# EAGLE design SpeechStorageModuleV10 (EAGLE 9.2.2)
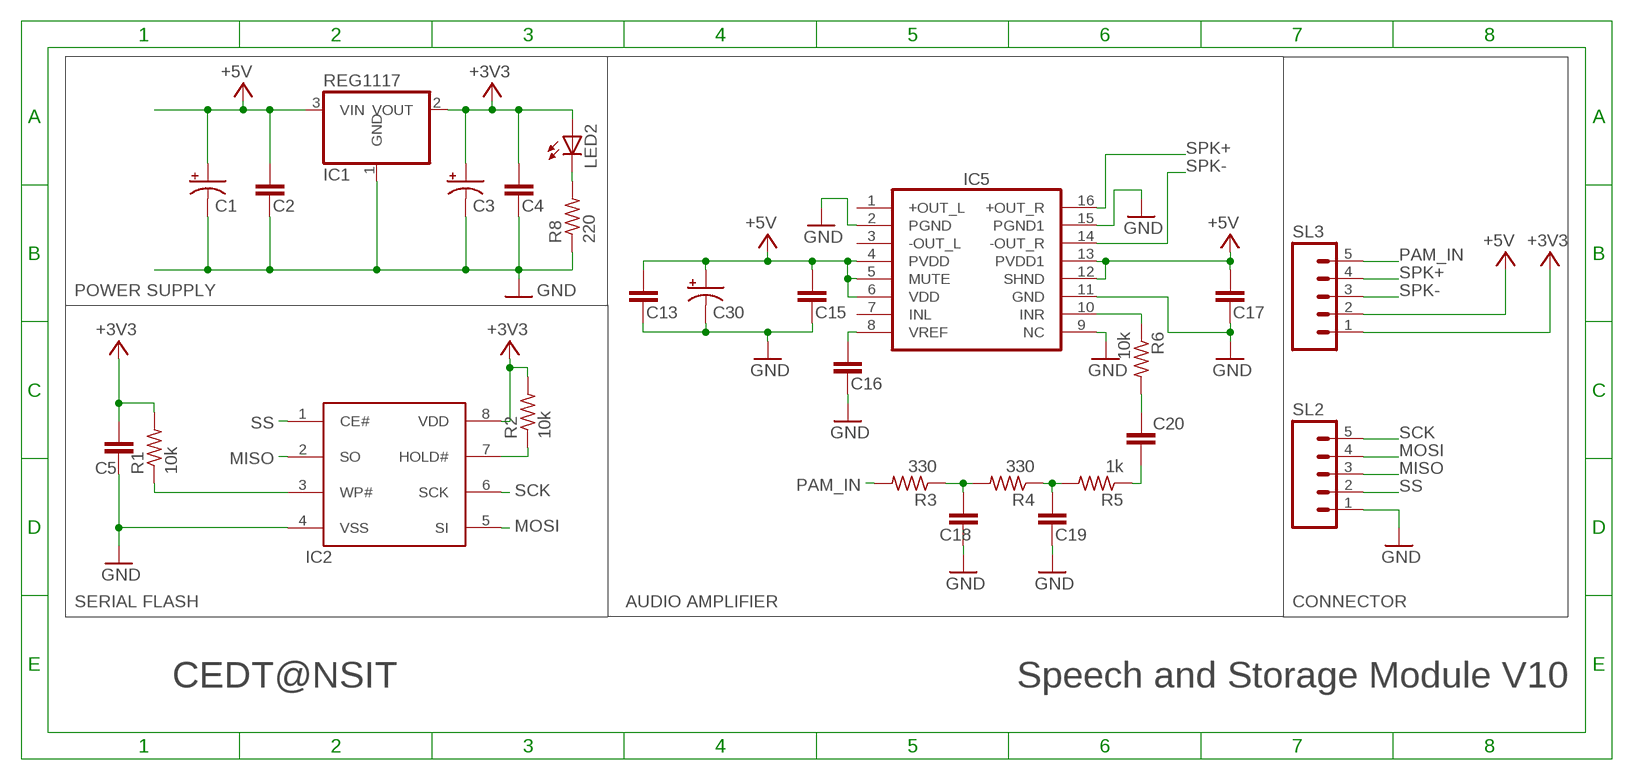
[diagram p0: schematic, sheet 1]

## Parts
C1  10u  CAP_POL_10V  [C/6032-28R]
C2  0.1uF  C-EUC1206  [C1206]
C3  10u  CAP_POL_10V  [C/6032-28R]
C4  0.1uF  C-EUC1206  [C1206]
C5  0.1u  C-EUC0805  [C0805]
C13  1uf  C-EUC1206  [C1206]
C15  1uf  C-EUC1206  [C1206]
C16  0.1uf  C-EUC1206  [C1206]
C17  1uf  C-EUC1206  [C1206]
C18  0.1u  C-EUC0805  [C0805]
C19  0.1uf  C-EUC0805  [C0805]
C20  0.47uF  C-EUC0805  [C0805]
C30  100u  CAP_POL_10V  [C/6032-28R]
IC1  REG1117  [SOT223]
IC2  SST25VF040B_SPI_FLASH  [SOIC08]
IC5  PAM8403  [SOP-16]
LED2  LED0805  [CHIPLED_0805]
R1  10k  RESISTOR0805  [R0805]
R2  10k  RESISTOR0805  [R0805]
R3  330  RESISTOR0805  [R0805]
R4  330  RESISTOR0805  [R0805]
R5  1k  RESISTOR0805  [R0805]
R6  10k  RESISTOR0805  [R0805]
R8  220  RESISTOR0805  [R0805]
SL2  M05  [05P]
SL3  M05  [05P]

## Nets
+3V3: C3.+ C4.2 C5.1 IC1.2(VOUT) IC2.8(VDD) LED2.A R1.2 R2.2 SL3.1
+5V: C1.+ C2.2 C13.1 C15.2 C17.2 C30.+ IC1.3(VIN) IC5.4(PVDD) IC5.5(MUTE) IC5.6(VDD) IC5.12(SHND) IC5.13(PVDD1) SL3.2
GND: C1.- C2.1 C3.- C4.1 C5.2 C13.2 C15.1 C16.2 C17.1 C18.2 C19.2 C30.- IC1.1(GND) IC2.4(VSS) IC5.2(PGND) IC5.9(NC) IC5.11(GND) IC5.15(PGND1) R8.1 SL2.1
MISO: IC2.2(SO) SL2.3
MOSI: IC2.5(SI) SL2.4
N$1: IC2.7(HOLD#) R2.1
N$2: C18.1 R3.1 R4.2
N$3: IC2.3(WP#) R1.1
N$4: C19.1 R4.1 R5.2
N$5: C20.1 R5.1
N$6: C20.2 R6.2
N$11: LED2.C R8.2
N$29: IC5.10(INR) R6.1
N$34: C16.1 IC5.8(VREF)
PAM_IN: R3.2 SL3.5
SCK: IC2.6(SCK) SL2.5
SPK+: IC5.16(+OUT_R) SL3.4
SPK-: IC5.14(-OUT_R) SL3.3
SS: IC2.1(CE#) SL2.2
Unconnected: IC5.1(+OUT_L) IC5.3(-OUT_L) IC5.7(INL)

## Notes on the sheet
- POWER SUPPLY
- SERIAL FLASH | AUDIO AMPLIFIER | CONNECTOR
- CEDT@NSIT | Speech and Storage Module V10

## Library data of the parts
C1 C3 C30 = CEDT_SEPTEMBER_V2:CAP_POL
C2 C4 C5 C13 C15-C17 C20 = rcl:C-EU: CAPACITOR, European symbol
C18 C19 = Arduino_Hackathon_v5:C-EU: CAPACITOR, European symbol
IC1 = CEDT_JANUARY_2015_v5:REG1117: 800mA and 1A Low Dropout (LDO) Positive Regulator 1.8V, 2.5V, 2.85V, 3.3V, 5V, and Adj
IC2 = CEDT_JANUARY_2015_v5:SST25VF040B_SPI_FLASH
IC5 = PAM8403:PAM8403: Dual channel audio amplifier IC - PAM8403
LED2 = CEDT_JANUARY_2015_v5:LED
R1-R6 R8 = CEDT_JANUARY_2015_v5:RESISTOR
SL2 SL3 = con-amp-quick:M05: AMP QUICK CONNECTOR; OC_FARNELL: unknown; OC_NEWARK: unknown

## Net classes
0 default: width 0.406 mm

## Board
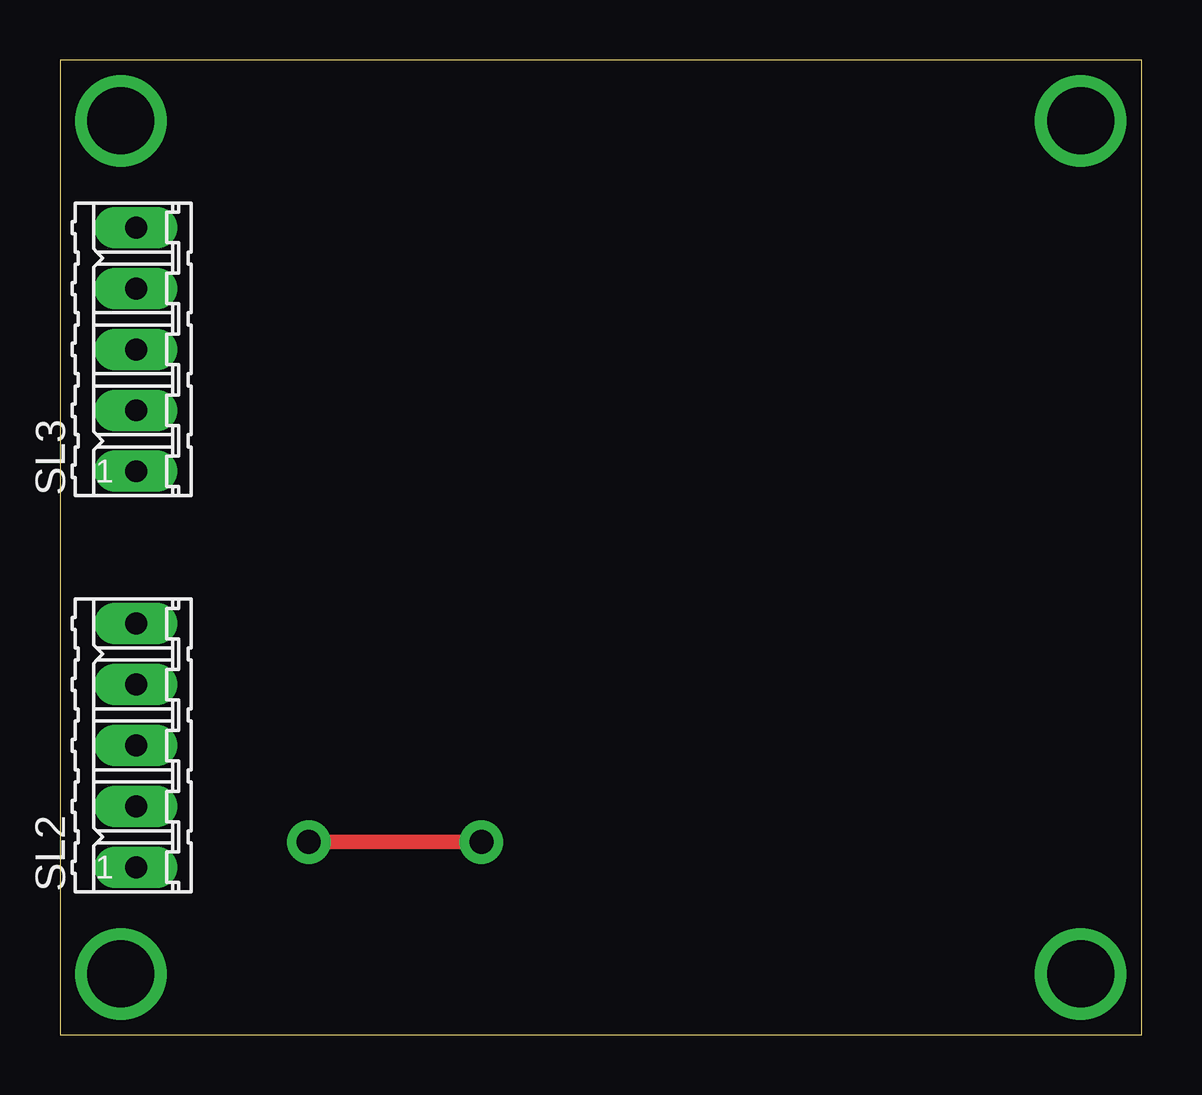
[diagram p1: board, top side]
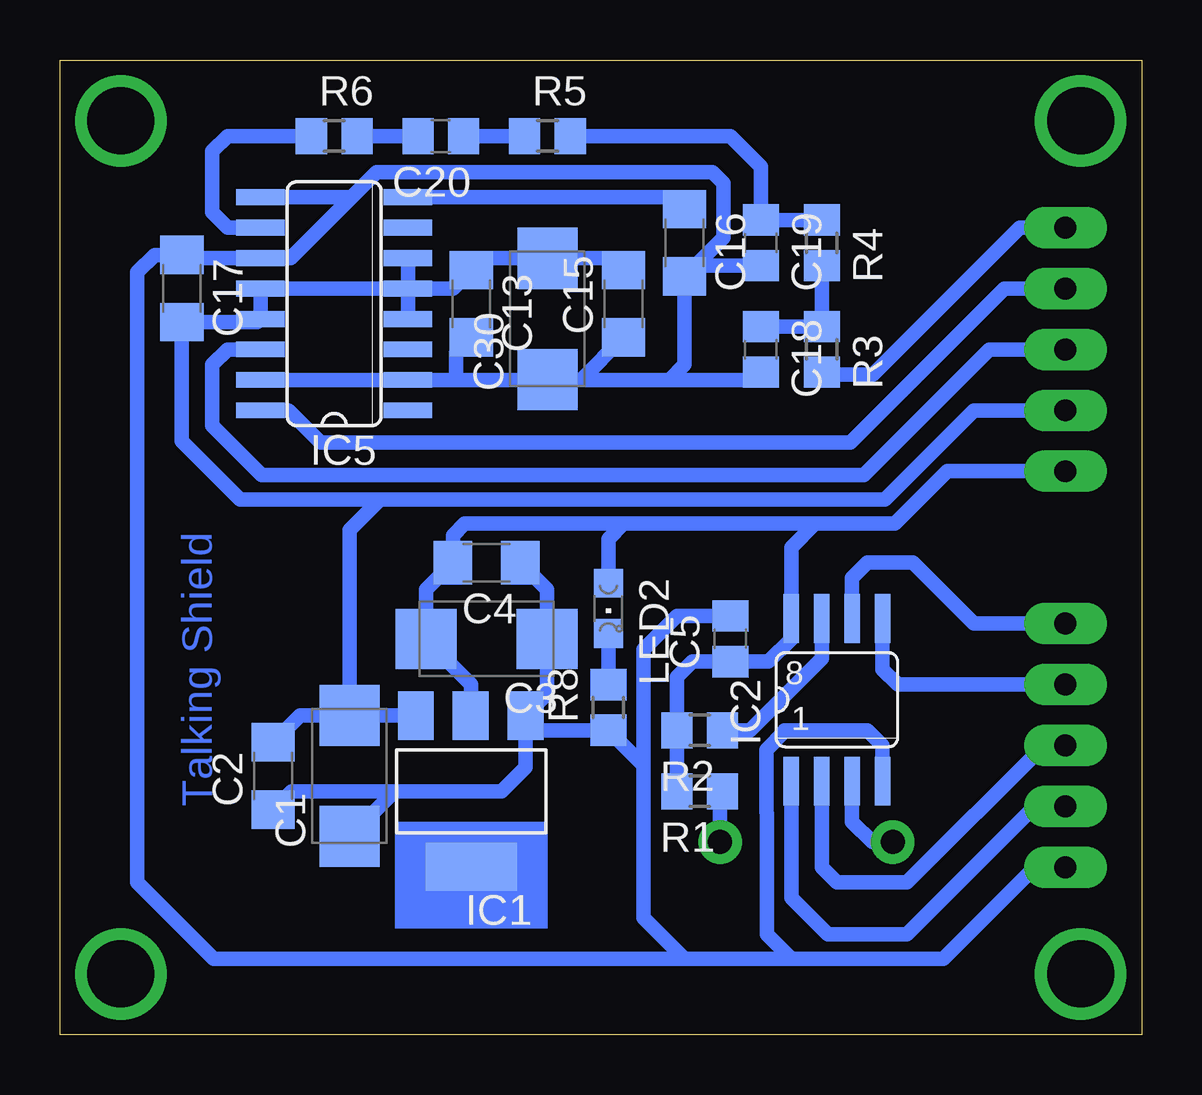
[diagram p2: board, bottom side, seen from below]

Size 45.09 x 40.64 mm. Coordinates in mm from the lower left corner, seen from the top.
Outline: 0,0 45.09,0 45.09,40.64 0,40.63 0,0
Copper layers (1*16): Top 0.035mm / dielectric 1.5mm / Bottom 0.035mm
Design rules "default *": minimum track width 6mil, minimum drill 0.35mm, track to track 16mil, track to pad 16mil, pad to pad 16mil, via to via 16mil, smd to smd 16mil, copper to edge 40mil, drill to drill 6mil, minimum pad ring 16mil, minimum via ring 16mil, stop-mask expansion 4mil, vias tented up to drill 0mil, thermal gap 10mil

### Footprints (pad centres in the part's own frame; a part is rotated, then mirrored left to right if it is on the bottom)
C/6032-28R = smd 2.55 x 2.5: + 2.525,0; - -2.525,0
C1206 = smd 1.6 x 1.8: 1 -1.4,0; 2 1.4,0
C0805 = smd 1.3 x 1.5: 1 -0.95,0; 2 0.95,0
SOT223 = smd 1.499 x 2.007: 1 -2.261,-3.15; 2 0.025,-3.15; 3 2.311,-3.15 | smd 3.81 x 2.007: 4 0,3.15
SOIC08 = smd 0.66 x 2.032: 1 -1.905,-3.391; 2 -0.635,-3.391; 3 0.635,-3.391; 4 1.905,-3.391; 5 1.905,3.391; 6 0.635,3.391; 7 -0.635,3.391; 8 -1.905,3.391
SOP-16 = smd 0.66 x 2.032: 1 -4.445,-3.073; 2 -3.175,-3.073; 3 -1.905,-3.073; 4 -0.635,-3.073; 5 0.635,-3.073; 6 1.905,-3.073; 7 3.175,-3.073; 8 4.445,-3.073; 9 4.445,3.073; 10 3.175,3.073; 11 1.905,3.073; 12 0.635,3.073; 13 -0.635,3.073; 14 -1.905,3.073; 15 -3.175,3.073; 16 -4.445,3.073
CHIPLED_0805 = smd 1.2 x 1.2: A 0,-1.05; C 0,1.05
R0805 = smd 1.3 x 1.5: 1 -0.95,0; 2 0.95,0
05P = drill 0.914 long: 1 -5.08,0; 2 -2.54,0; 3 0,0; 4 2.54,0; 5 5.08,0

### Placement (x,y rotation side)
C1  33.02,10.79 90 bottom
C2  36.2,10.79 90 bottom
C3  27.3,16.51 180 bottom
C4  27.3,19.68 180 bottom
C5  17.14,16.51 90 bottom
C13  27.94,30.48 270 bottom
C15  21.59,30.48 90 bottom
C16  19.05,33.02 270 bottom
C17  40.01,31.11 270 bottom
C18  15.88,28.57 270 bottom
C19  15.88,33.02 270 bottom
C20  29.21,37.47 180 bottom
C30  24.77,29.84 90 bottom
IC1  27.94,10.16 180 bottom
IC2  12.7,13.97 0 bottom
IC5  33.66,30.48 90 bottom
LED2  22.23,17.78 180 bottom
R1  18.41,10.16 180 bottom
R2  18.41,12.7 180 bottom
R3  13.34,28.57 270 bottom
R4  13.34,33.02 270 bottom
R5  24.77,37.47 0 bottom
R6  33.66,37.47 0 bottom
R8  22.23,13.65 90 bottom
SL2  3.17,12.06 90 top
SL3  3.17,28.57 90 top

### Tracks (layer width: path | path; a pad name or v marks a point on that pad's centre or on a via)
+3V3
  Bottom 0.61: R1.2 R2.2 19.36,14.93 18.73,15.56 C5.1 15.55,15.56 14.61,16.51 IC2.8 14.61,20.32 13.61,21.31 | IC1.2 27.94,13.34 27.94,14.61 29.83,16.5 C3.+ 29.83,18.56 C4.2 28.7,20.82 28.22,21.31 21.59,21.31 | LED2.A 22.23,20.68 21.59,21.31 | 21.59,21.31 13.61,21.31 | 13.61,21.31 11.43,21.31 11.21,21.31 10.27,21.31 8.09,23.5 SL3.1
+5V
  Bottom 0.61: IC5.5 IC5.4 | IC5.5 IC5.12 IC5.13 36.86,29.71 C17.2 40.01,24.77 37.57,22.33 31.75,22.33 | IC5.5 IC5.6 | 30.46,13.52 IC1.3 C1.+ | IC5.5 28.7,31.11 C13.1 27.45,32.37 C30.+ 22.08,32.37 C15.2 | 31.75,22.33 33.02,21.06 C1.+ | C1.+ 35.07,13.32 C2.2 | SL3.2 6.99,26.04 10.69,22.33 31.75,22.33
GND
  Bottom 0.61: C19.2 18.6,32.07 | 18.6,32.07 C16.2 19.05,27.94 19.68,27.3 | IC5.9 32.93,34.92 | 32.93,34.92 31.89,35.97 17.89,35.97 17.44,35.52 17.44,33.23 18.6,32.07 | C18.2 15.88,27.3 19.68,27.3 | 32.93,34.92 35.47,32.38 IC5.11 39.88,32.38 C17.1 41.15,32.52 41.86,31.8 41.86,6.35 38.68,3.17 19.05,3.17 | IC5.15 IC5.2 28.57,27.3 | IC2.4 10.79,12.06 11.43,12.7 14.89,12.7 14.89,12.64 15.65,11.89 15.65,9.27 15.62,9.24 15.62,4.19 14.61,3.17 | IC1.1 25.41,13.57 | IC1.1 25.68,11.15 26.67,10.16 31.13,10.16 | 31.13,10.16 35.43,10.16 C2.1 | IC1.1 24.78,14.21 C3.- 24.78,18.56 C4.1 | C5.2 19.37,17.46 20.76,16.07 20.76,11.24 | 28.57,27.3 24.78,27.3 | 24.78,27.3 C30.- | C13.2 28.57,28.45 28.57,27.3 | 19.68,27.3 23.36,27.3 | C15.1 23.36,27.3 | 23.36,27.3 24.78,27.3 | 14.61,3.17 8.26,3.17 4.45,6.99 SL2.1 | 14.61,3.17 19.05,3.17 | 20.76,11.24 20.76,4.89 19.05,3.17 | IC1.1 25.07,12.7 R8.1 20.76,11.24 | C1.- 31.13,10.16
MISO
  Bottom 0.61: IC2.2 13.34,6.99 12.7,6.35 9.78,6.35 4.06,12.06 SL2.3
MOSI
  Bottom 0.61: IC2.5 10.79,15.24 10.16,14.61 SL2.4
N$1
  Bottom 0.61: IC2.7 13.34,15.69 16.33,12.7 R2.1
N$2
  Bottom 0.61: R4.2 R3.1 C18.1
N$3  (via drill 1 pad 1.68)
  Top 0.61: v10.37,8.04 v17.57,8.04
  Bottom 0.61: IC2.3 12.06,8.89 11.22,8.04 v10.37,8.04 | R1.1 17.57,10.05 v17.57,8.04
N$4
  Bottom 0.61: 23.5,37.15 R5.2 17.14,37.47 15.88,36.2 C19.1 R4.1
N$5
  Bottom 0.61: R5.1 C20.1
N$6
  Bottom 0.61: C20.2 R6.2
N$7  (via drill 2.79)
  other vias: 42.55,38.1 42.55,2.54 2.54,2.54 2.54,38.1
N$11
  Bottom 0.61: LED2.C R8.2
N$29
  Bottom 0.61: IC5.10 38.1,33.66 38.73,34.29 38.73,36.83 38.1,37.47 R6.1
N$34
  Bottom 0.61: IC5.8 19.55,34.92 C16.1
PAM_IN
  Bottom 0.61: 13.34,27.3 13.21,27.43 13.21,27.75 R3.2 13.24,27.53 11.21,27.53 5.08,33.66 SL3.5
SCK
  Bottom 0.61: IC2.6 12.06,19.05 11.43,19.68 9.53,19.68 6.99,17.14 SL2.5
SPK+
  Bottom 0.61: IC5.16 35.56,26.04 34.22,24.7 12.13,24.7 5.71,31.11 SL3.4
SPK-
  Bottom 0.61: IC5.14 38.1,28.57 38.73,27.94 38.73,25.4 36.68,23.34 11.58,23.34 6.35,28.57 SL3.3
SS
  Bottom 0.61: IC2.1 14.61,5.71 13.08,4.19 9.78,4.19 4.45,9.53 SL2.2
(copper drawn outside any net)
  shapes: Bottom area x1

### Text on the board
Bottom: Talking Shield